# EAGLE schematic SpringX (EAGLE 6.4)
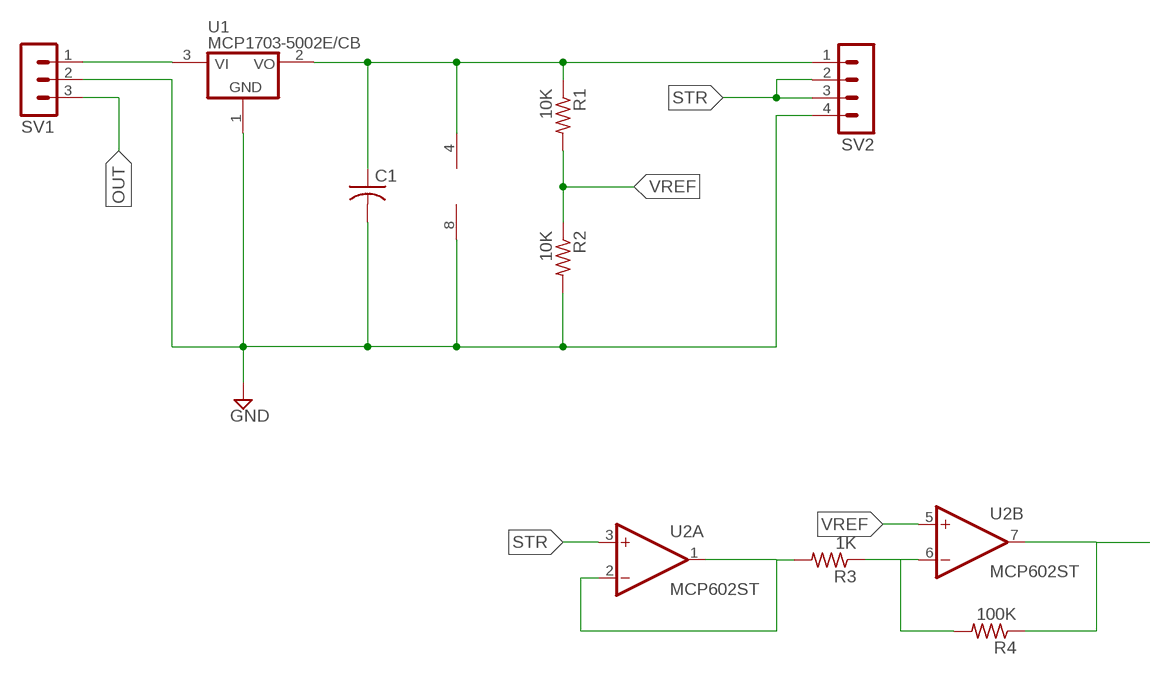
[diagram p0: schematic, sheet 1]

## Parts
C1  C-USC0603  [C0603]
R1  10K  R-US_R0603  [R0603]
R2  10K  R-US_R0603  [R0603]
R3  1K  R-US_R0603  [R0603]
R4  100K  R-US_R0603  [R0603]
SV1  MA03-1  [MA03-1]
SV2  MA04-1  [MA04-1]
U1  MCP1703-5002E/CB  [SOT23A_MICROCHIP_CB]
U2  MCP602ST  [TSSOP8]

## Nets
5V: C1.1 R1.1 SV2.1 U1.2(VO) U2.4(P:V-)
GND: C1.2 R2.2 SV1.2 SV2.4 U1.1(GND) U2.8(P:V+)
N$1: SV1.1 U1.3(VI)
N$2: R3.2 U2.1(A:OUT) U2.2(A:-IN)
N$4: R3.1 R4.2 U2.6(B:-IN)
OUT: R4.1 SV1.3 U2.7(B:OUT)
STR: SV2.2 SV2.3 U2.3(A:+IN)
VREF: R1.2 R2.1 U2.5(B:+IN)

## Library data of the parts
C1 = rcl:C-US: CAPACITOR, American symbol
R1-R4 = resistor:R-US_: RESISTOR, American symbol
SV1 = con-lstb:MA03-1: PIN HEADER; OC_FARNELL: unknown; OC_NEWARK: unknown
SV2 = con-lstb:MA04-1: PIN HEADER; OC_FARNELL: unknown; OC_NEWARK: unknown
U1 = _hhn_MCP1703:MCP1703*02E/CB: MCP1703[A] Series of Voltage Regulators – SOT23A (Microchip CB) (1.2 … 5.0)V, LDO, 16 V Input, 100/150/200/250 mA, Low Quiescent Current Source: http://ww1.microchip.com/downloads/en/DeviceDoc/22049f.pdf http://ww1.microchip.com/downloads/en/DeviceDoc/25122A.pdf Packages: SOT23, Microchip package identifier "CB" (dimensions and recommended land patterns acc. to Microchip) Technologies: MCP1703[A]T-xx02E/CB T : Tape and Reel xx: Output Voltage * 1000 mV; 12|15|18|25|28|30|33|40|50 0 : Extra Feature Code (fixed) 2 : Output volt. Tol.: ±2% (standard) E : Temperature range (−40…+125)°C CB: Package: SOT23A Author: Dipl.-Ing. FH Rainer Bayer HHN Hochschule Heilbronn, rainer.bayer@hs-heilbronn.de Ingenieurbüro ing-rb, mail@ing-rb.de
U2 = linear:MCP602: Single Op Amp 2.7V to 6.0V Single Supply CMOS Source: http://ww1.microchip.com/downloads/en/DeviceDoc/21314g.pdf